# EAGLE design Temperature sensor 32U4 (EAGLE 9.5.2)
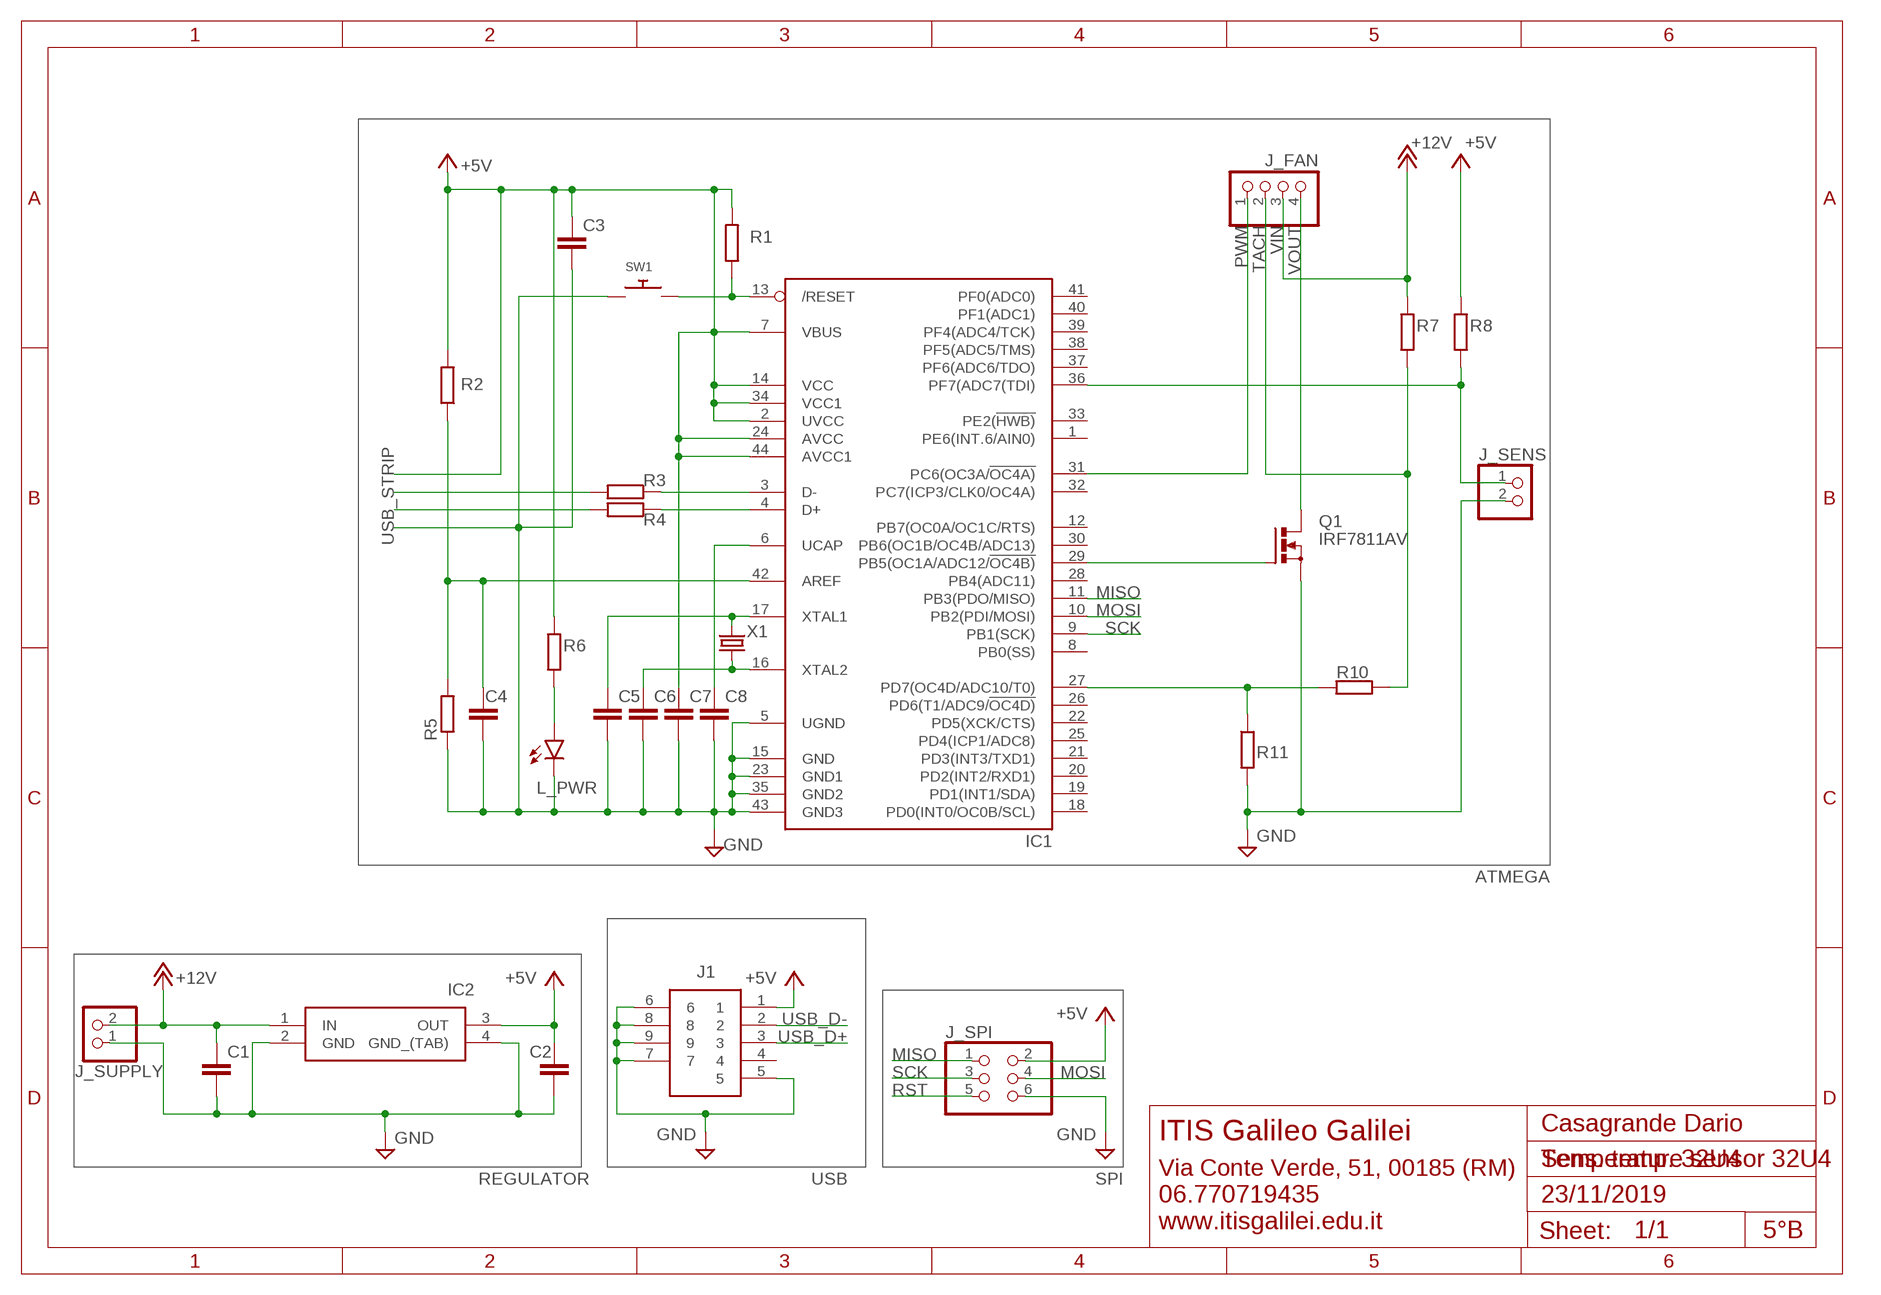
[diagram p0: schematic, sheet 1]

## Parts
C1  470n  C-EUC1206  [C1206]
C2  47u  C-EUC1206  [C1206]
C3  1u  C-EUC1206  [C1206]
C4  1u  C-EUC1206  [C1206]
C5  22p  C-EUC1206  [C1206]
C6  22p  C-EUC1206  [C1206]
C7  100n  C-EUC1206  [C1206]
C8  1u  C-EUC1206  [C1206]
IC1  ATMEGA32U4-AU  [TQFP44]
IC2  LM2940CS-5.0_NOPB  [TO254P1435X464-4N]
J1  10104111-0001LF  [101041110001LF]
J_FAN  PINHD-1X4  [1X04]
J_SENS  PINHD-1X2  [1X02]
J_SPI  PINHD-2X3  [2X03]
J_SUPPLY  PINHD-1X2  [1X02]
L_PWR  LEDCHIPLED_1206  [CHIPLED_1206]
Q1  IRF7811AV  N-MOSFET-SO8S  [SO-08]
R1  10k  R-EU_R1206  [R1206]
R2  1,8k  R-EU_R1206  [R1206]
R3  10  R-EU_R1206  [R1206]
R4  10  R-EU_R1206  [R1206]
R5  8,2k  R-EU_R1206  [R1206]
R6  270  R-EU_R1206  [R1206]
R7  10k  R-EU_R1206  [R1206]
R8  10k  R-EU_R1206  [R1206]
R10  10k  R-EU_R1206  [R1206]
R11  14k  R-EU_R1206  [R1206]
SW1  SWITCH_PUSHBUTTONSOFTTOUCHSMD_SJ  [PUSHBUTTON_SMD_SJ]
X1  16MHz  CRYSTALHC49S  [HC49/S]

## Nets
+5V: C2.1 C3.1 C7.1 IC1.2(UVCC) IC1.7(VBUS) IC1.14(VCC) IC1.24(AVCC) IC1.34(VCC1) IC1.44(AVCC1) IC2.3(OUT) J1.1 J_SPI.2 R1.2 R2.2 R6.1 R8.1
+12V: C1.1 IC2.1(IN) J_SUPPLY.2
AREF: C4.1 IC1.42(AREF) R2.1 R5.2
D+: IC1.4(D+) R4.1
D-: IC1.3(D-) R3.1
GND: C1.2 C2.2 C3.2 C4.2 C5.2 C6.2 C7.2 C8.2 IC1.5(UGND) IC1.15(GND) IC1.23(GND1) IC1.35(GND2) IC1.43(GND3) IC2.2(GND) IC2.4(GND_(TAB)) J1.5 J1.6 J1.7 J1.8 J1.9 J_SENS.2 J_SPI.6 J_SUPPLY.1 L_PWR.C Q1.1(S) Q1.2(S) Q1.3(S) R5.1 R11.2 SW1.P$1
MISO: IC1.11(PB3(PDO/MISO)) J_SPI.1
MOSI: IC1.10(PB2(PDI/MOSI)) J_SPI.4
N$1: L_PWR.A R6.2
N$2: IC1.29(PB5(OC1A/ADC12/!OC4B)) Q1.4(G)
PWM: IC1.31(PC6(OC3A/!OC4A)) J_FAN.1
RST: IC1.13(/RESET) J_SPI.5 R1.1 SW1.P$2
SCK: IC1.9(PB1(SCK)) J_SPI.3
SENS: IC1.36(PF7(ADC7(TDI)) J_SENS.1 R8.2
TACH: J_FAN.2 R7.2 R10.1
TACH_IN: IC1.27(PD7(OC4D/ADC10/T0)) R10.2 R11.1
UCAP: C8.1 IC1.6(UCAP)
USB_D+: J1.3 R4.2
USB_D-: J1.2 R3.2
VIN: J_FAN.3 R7.1 ; supply symbol labelled +12V
VOUT: J_FAN.4 Q1.5(D) Q1.6(D) Q1.7(D) Q1.8(D)
XTAL1: C5.1 IC1.17(XTAL1) X1.2
XTAL2: C6.1 IC1.16(XTAL2) X1.1
Unconnected: IC1.1(PE6(INT.6/AIN0)) IC1.8(PB0(SS)) IC1.12(PB7(OC0A/OC1C/RTS)) IC1.18(PD0(INT0/OC0B/SCL)) IC1.19(PD1(INT1/SDA)) IC1.20(PD2(INT2/RXD1)) IC1.21(PD3(INT3/TXD1)) IC1.22(PD5(XCK/CTS)) IC1.25(PD4(ICP1/ADC8)) IC1.26(PD6(T1/ADC9/!OC4D)) IC1.28(PB4(ADC11)) IC1.30(PB6(OC1B/OC4B/ADC13)) IC1.32(PC7(ICP3/CLK0/OC4A)) IC1.33(PE2(!HWB)) IC1.37(PF6(ADC6/TDO)) IC1.38(PF5(ADC5/TMS)) IC1.39(PF4(ADC4/TCK)) IC1.40(PF1(ADC1)) IC1.41(PF0(ADC0)) J1.4

## Notes on the sheet
- USB_STRIP
- ATMEGA
- Casagrande Dario
- ITIS Galileo Galilei
- Sens. temp. 32U4
- Via Conte Verde, 51, 00185 (RM)
- REGULATOR | USB | SPI
- 06.770719435 | 23/11/2019
- www.itisgalilei.edu.it
- 5°B

## Library data of the parts
C1-C8 = rcl:C-EU: CAPACITOR, European symbol; SPICEPREFIX: C
IC1 = adafruit:ATMEGA32U4: http://www.ladyada.net/library/eagle
IC2 = LM2940CS-5.0_NOPB:LM2940CS-5.0_NOPB: 1A,5V,LDO Voltage Regulator,LM2940CS-5.0 Source: Datasheet <http://www.ti.com/lit/ds/symlink/lm2940c.pdf>; DESCRIPTION: 1A,5V,LDO Voltage Regulator,LM2940CS-5.0; HEIGHT: 4.64mm; MANUFACTURER_NAME: Texas Instruments; MANUFACTURER_PART_NUMBER: LM2940CS-5.0/NOPB; MOUSER_PART_NUMBER: 926-LM2940CS-5.0NOPB; MOUSER_PRICE-STOCK: https://www.mouser.com/Search/Refine.aspx?Keyword=926-LM2940CS-5.0NOPB; RS_PART_NUMBER: 2508123693; RS_PRICE-STOCK: http://uk.rs-online.com/web/p/products/2508123693
J1 = USB:10104111-0001LF: USB Connectors 5P Quick Connect MicroUSB TypeAB Rcpt Source: Datasheet <https://cdn.amphenol-icc.com/media/wysiwyg/files/drawing/10104111.pdf>; ALLIED_NUMBER: 70236825; ALLIED_PRICE-STOCK: https://www.alliedelec.com/amphenolfci-10104111-0001lf/70236825/; DESCRIPTION: USB Connectors 5P Quick Connect MicroUSB TypeAB Rcpt; HEIGHT: 3.07mm; MANUFACTURER_NAME: Amphenol; MANUFACTURER_PART_NUMBER: 10104111-0001LF; MOUSER_PART_NUMBER: 649-10104111-0001LF; MOUSER_PRICE-STOCK: https://www.mouser.com/Search/Refine.aspx?Keyword=649-10104111-0001LF; RS_PART_NUMBER: 7142353; RS_PRICE-STOCK: http://uk.rs-online.com/web/p/products/7142353
J_FAN = pinhead:PINHD-1X4: PIN HEADER
J_SENS J_SUPPLY = pinhead:PINHD-1X2: PIN HEADER
J_SPI = pinhead:PINHD-2X3: PIN HEADER
L_PWR = led:LED: LED OSRAM: - CHIPLED LG R971, LG N971, LY N971, LG Q971, LY Q971, LO R971, LY R971 LH N974, LH R974 LS Q976, LO Q976, LY Q976 LO Q996 - Hyper CHIPLED LW Q18S LB Q993, LB Q99A, LB R99A - SideLED LS A670, LO A670, LY A670, LG A670, LP A670 LB A673, LV A673, LT A673, LW A673 LH A674 LY A675 LS A676, LA A676, LO A676, LY A676, LW A676 LS A679, LY A679, LG A679 - Hyper Micro SIDELED® LS Y876, LA Y876, LO Y876, LY Y876 LT Y87S - SmartLED LW L88C, LW L88S LB L89C, LB L89S, LG L890 LS L89K, LO L89K, LY L89K LS L896, LA L896, LO L896, LY L896 - TOPLED LS T670, LO T670, LY T670, LG T670, LP T670 LSG T670, LSP T670, LSY T670, LOP T670, LYG T670 LG T671, LOG T671, LSG T671 LB T673, LV T673, LT T673, LW T673 LH T674 LS T676, LA T676, LO T676, LY T676, LB T676, LH T676, LSB T676, LW T676 LB T67C, LV T67C, LT T67C, LS T67K, LO T67K, LY T67K, LW E67C LS E67B, LA E67B, LO E67B, LY E67B, LB E67C, LV E67C, LT E67C LW T67C LS T679, LY T679, LG T679 LS T770, LO T770, LY T770, LG T770, LP T770 LB T773, LV T773, LT T773, LW T773 LH T774 LS E675, LA E675, LY E675, LS T675 LS T776, LA T776, LO T776, LY T776, LB T776 LHGB T686 LT T68C, LB T68C - Hyper Mini TOPLED® LB M676 - Mini TOPLED Santana® LG M470 LS M47K, LO M47K, LY M47K Source: http://www.osram.convergy.de LUXEON: - LUMILED® LXK2-PW12-R00, LXK2-PW12-S00, LXK2-PW14-U00, LXK2-PW14-V00 LXK2-PM12-R00, LXK2-PM12-S00, LXK2-PM14-U00 LXK2-PE12-Q00, LXK2-PE12-R00, LXK2-PE12-S00, LXK2-PE14-T00, LXK2-PE14-U00 LXK2-PB12-K00, LXK2-PB12-L00, LXK2-PB12-M00, LXK2-PB14-N00, LXK2-PB14-P00, LXK2-PB14-Q00 LXK2-PR12-L00, LXK2-PR12-M00, LXK2-PR14-Q00, LXK2-PR14-R00 LXK2-PD12-Q00, LXK2-PD12-R00, LXK2-PD12-S00 LXK2-PH12-R00, LXK2-PH12-S00 LXK2-PL12-P00, LXK2-PL12-Q00, LXK2-PL12-R00 Source: www.luxeon.com KINGBRIGHT: KA-3528ASYC Source: www.kingbright.com
Q1 = transistor-power:N-MOSFET-SO8: N-Channel MOSFET Example: FDS7760A; N-Channel Logic Level PowerTrench® MOSFET FDS2572; N-Channel UltraFET® Trench MOSFET Source: www.fairchildsemi.com
R1-R8 R10 R11 = rcl:R-EU_: RESISTOR, European symbol; SPICEPREFIX: R
SW1 = adafruit:SWITCH_PUSHBUTTON: Buttons SOFTTOUCHSMD_SJ - Soft touch temporary push button (Super Junk Akihabara) Compatible with SKPMANE010 [Mouser: 688-SKPMAN] C&K_KSS = Digikey: KSS221GLFS
X1 = adafruit:CRYSTAL: CRYSTAL; OC_FARNELL: 1667008; OC_NEWARK: unknown

## Board
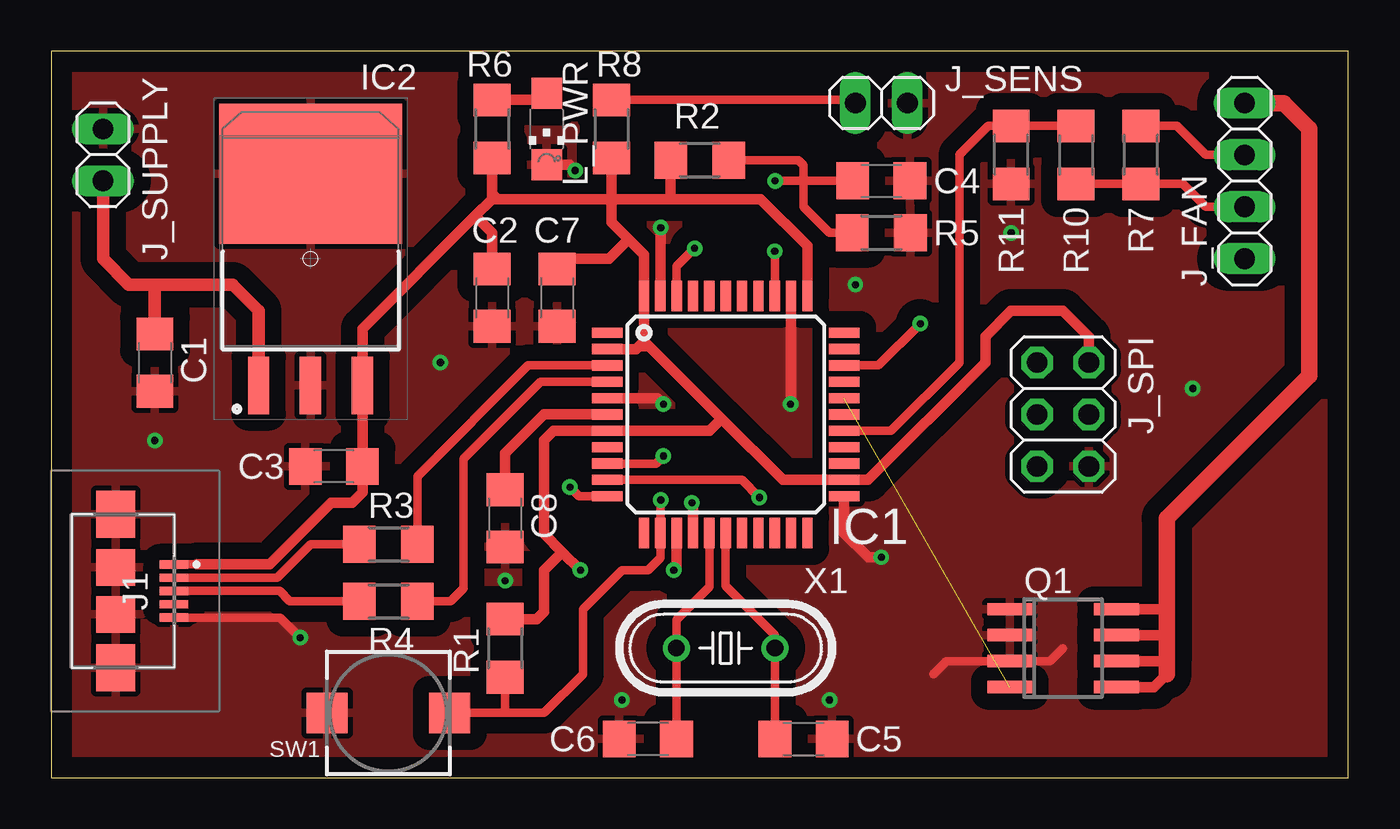
[diagram p1: board, top side]
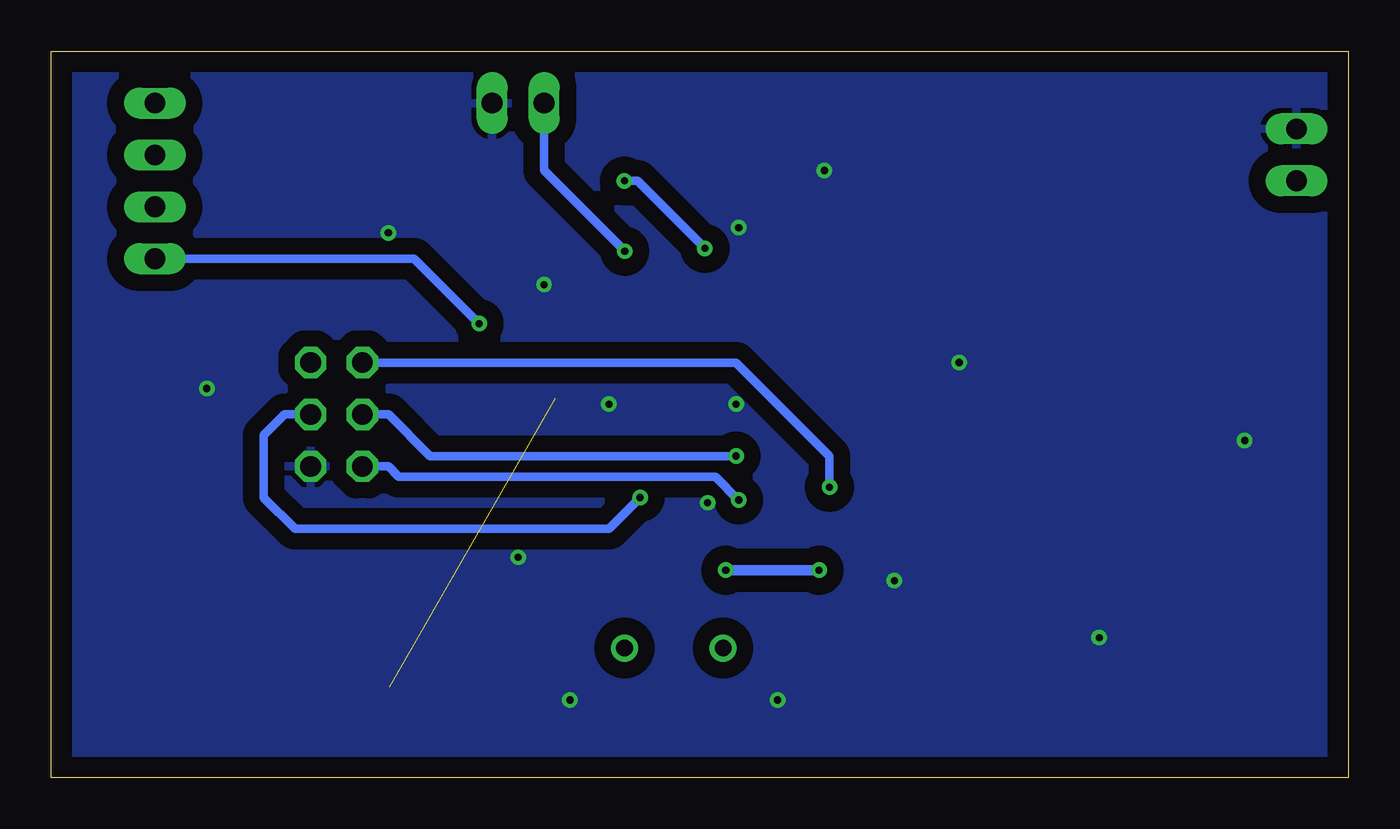
[diagram p2: board, bottom side, seen from below]

Size 63.5 x 35.56 mm. Coordinates in mm from the lower left corner, seen from the top.
Outline: 0,0 63.5,0 63.5,35.56 0,35.56 0,0
Copper layers (1*16): Top 0.035mm / dielectric 1.5mm / Bottom 0.035mm
Design rules "default": minimum track width 6mil, minimum drill 0.35mm, track to track 6mil, track to pad 6mil, pad to pad 6mil, via to via 6mil, smd to smd 6mil, copper to edge 40mil, drill to drill 6mil, minimum pad ring 10mil, minimum via ring 8mil, stop-mask expansion 4mil, vias tented up to drill 0mil, thermal gap 10mil

### Footprints (pad centres in the part's own frame; a part is rotated, then mirrored left to right if it is on the bottom)
C1206 = smd 1.6 x 1.8: 1 -1.4,0; 2 1.4,0
TQFP44 = smd 1.5 x 0.5: 1 -5.8,4; 2 -5.8,3.2; 3 -5.8,2.4; 4 -5.8,1.6; 5 -5.8,0.8; 6 -5.8,0; 7 -5.8,-0.8; 8 -5.8,-1.6; 9 -5.8,-2.4; 10 -5.8,-3.2; 11 -5.8,-4; 23 5.8,-4; 24 5.8,-3.2; 25 5.8,-2.4; 26 5.8,-1.6; 27 5.8,-0.8; 28 5.8,0; 29 5.8,0.8; 30 5.8,1.6; 31 5.8,2.4; 32 5.8,3.2; 33 5.8,4 | smd 0.5 x 1.5: 12 -4,-5.8; 13 -3.2,-5.8; 14 -2.4,-5.8; 15 -1.6,-5.8; 16 -0.8,-5.8; 17 0,-5.8; 18 0.8,-5.8; 19 1.6,-5.8; 20 2.4,-5.8; 21 3.2,-5.8; 22 4,-5.8; 34 4,5.8; 35 3.2,5.8; 36 2.4,5.8; 37 1.6,5.8; 38 0.8,5.8; 39 0,5.8; 40 -0.8,5.8; 41 -1.6,5.8; 42 -2.4,5.8; 43 -3.2,5.8; 44 -4,5.8
TO254P1435X464-4N = smd 2.8 x 1.05: 1 -6.2,2.54; 2 -6.2,0; 3 -6.2,-2.54 | smd 6.85 x 8.95: 4 4.15,0
101041110001LF = smd 0.4 x 1.4: 1 -1.3,5; 2 -0.65,5; 3 0,5; 4 0.65,5; 5 1.3,5 | smd 2.3 x 1.9: 6 -3.75,2.15; 7 3.75,2.15 | smd 1.8 x 1.9: 8 -1.15,2.15; 9 1.15,2.15
1X04 = drill 1.016 long: 1 -3.81,0; 2 -1.27,0; 3 1.27,0; 4 3.81,0
1X02 = drill 1.016 long: 1 -1.27,0; 2 1.27,0
2X03 = drill 1.016 octagon: 1 -2.54,-1.27; 2 -2.54,1.27; 3 0,-1.27; 4 0,1.27; 5 2.54,-1.27; 6 2.54,1.27
CHIPLED_1206 = smd 1.5 x 1.5: A 0,-1.75; C 0,1.75
SO-08 = smd 0.6 x 2.2: 1 -1.905,-2.6; 2 -0.635,-2.6; 3 0.635,-2.6; 4 1.905,-2.6; 5 1.905,2.6; 6 0.635,2.6; 7 -0.635,2.6; 8 -1.905,2.6
R1206 = smd 1.6 x 1.803: 1 -1.422,0; 2 1.422,0
PUSHBUTTON_SMD_SJ = smd 2 x 2: P$1 3,0; P$2 -3,0
HC49/S = drill 0.813: 1 -2.413,0; 2 2.413,0

### Placement (x,y rotation side)
C1  5.08,20.32 270 top
C2  21.59,23.5 270 top
C3  13.84,15.24 180 top
C4  40.64,29.21 0 top
C5  36.83,1.91 0 top
C6  29.21,1.91 180 top
C7  24.77,23.5 270 top
C8  22.23,12.7 270 top
IC1  33.02,17.78 0 top
IC2  12.7,25.4 90 top
J1  1.02,9.14 270 top
J_FAN  58.42,29.21 90 top
J_SENS  40.64,33.02 0 top
J_SPI  49.53,17.78 270 top
J_SUPPLY  2.54,30.48 270 top
L_PWR  24.26,31.75 180 top
Q1  49.53,6.35 270 top
R1  22.23,6.35 90 top
R2  31.75,30.23 180 top
R3  16.51,11.43 180 top
R4  16.51,8.64 180 top
R5  40.64,26.67 180 top
R6  21.59,31.75 90 top
R7  53.34,30.48 270 top
R8  27.43,31.75 90 top
R10  50.16,30.48 90 top
R11  46.99,30.48 270 top
SW1  16.51,3.17 180 top
X1  33.02,6.35 0 top

### Tracks (layer width: path | path; a pad name or v marks a point on that pad's centre or on a via)
+5V  (via drill 0.35)
  Top 0.203: 28.63,20.98 29.36,20.98 29.39,21.01
  Top 0.406: J1.1 7.14,10.44
  Top 0.508: IC1.34 37.02,26.04 34.73,28.32 30.48,28.32 | 21.59,28.32 21.84,28.32 | 21.84,28.32 27.3,28.32 | 27.3,28.32 30.48,28.32 | 21.59,28.32 20.77,27.5 | 20.77,27.5 15.24,21.97 IC2.3 C3.1 | R8.1 27.43,28.45 | 27.43,28.45 27.3,28.32 | R6.1 21.59,28.57 | 21.59,28.57 21.59,28.32 | 21.59,28.57 21.84,28.32 | C3.1 | C3.1 15.24,13.97 14.73,13.46 13.72,13.46 10.7,10.44 7.14,10.44 | R2.2 30.33,28.47 30.48,28.32 | 28.26,26.35 29.02,25.59 IC1.44 29.02,21.37 | 28.26,26.35 27.43,27.18 27.43,28.45 | 32.82,17.58 35.81,14.58 IC1.24 39.98,14.58 45.72,20.32 45.72,21.59 46.99,22.86 49.53,22.86 50.8,21.59 J_SPI.2 | 32.82,17.58 29.39,21.01 29.02,21.37 | C2.1 21.59,26.67 20.77,27.5 | C7.1 25.27,25.4 27.3,25.4 28.26,26.35 | IC1.2 28.63,20.98 29.02,21.37 | 32.82,17.58 32.22,16.98 IC1.7 24.6,16.98 24.13,16.51 24.13,11.94 25.02,11.05 | 25.02,11.05 v25.91,10.16 | IC1.14 30.62,10.3 v30.48,10.16 | R1.2 23.77,7.77 24.13,8.13 24.13,10.16 25.02,11.05
  Bottom 0.508: v25.91,10.16 v30.48,10.16
+12V
  Top 0.61: 5.08,24.13 8.89,24.13 10.16,22.86 IC2.1 | 5.08,24.13 3.81,24.13 2.54,25.4 J_SUPPLY.2 | C1.1 5.08,24.13
AREF  (via drill 0.35)
  Top 0.406: R5.2 38.1,26.67 36.83,27.94 36.83,29.21 | C4.1 36.83,29.21 | R2.1 36.58,30.23 36.83,29.97 36.83,29.21 | 36.83,29.21 v35.43,29.21 | v31.5,25.91 30.62,25.03 IC1.42
  Bottom 0.406: v31.5,25.91 34.8,29.21 v35.43,29.21
D+
  Top 0.406: R4.1 19.56,8.64 20.19,9.27 20.19,15.62 23.95,19.38 IC1.4
D-
  Top 0.406: IC1.3 23.36,20.18 17.93,14.76 R3.1
GND  (via drill 0.35)
  Top 0.406: v12.19,6.86 11.21,7.84 J1.5 | 43.18,5.08 43.81,5.71 Q1.3 48.9,5.71 49.53,6.35
  Top 0.508: IC1.15 31.42,13.41 v31.37,13.46 | IC1.23 38.82,11.98 40.01,10.79 v40.64,10.79 | IC1.43 29.82,26.9 v29.84,26.92 | IC1.5 29.68,18.58 v29.97,18.29 | L_PWR.C 25.37,30 v25.65,29.72 | IC1.35 36.22,18.31 v36.2,18.29
  other vias: 19.05,20.32 22.23,9.65 46.99,26.67 55.88,19.05 27.94,3.81 38.1,3.81 39.37,24.13 5.08,16.51
  pour Bottom (isolate 0.813): -1.27,36.83 64.77,36.83 64.77,-1.27 -1.27,-1.27
  pour Top (isolate 0.813): 0,35.56 63.5,35.56 63.5,0 0,0
MISO  (via drill 0.35)
  Top 0.406: v25.4,14.22 25.84,13.78 IC1.11
  Bottom 0.406: J_SPI.1 29.97,20.32 25.4,15.75 v25.4,14.22
MOSI  (via drill 0.35)
  Top 0.406: IC1.10 33.81,14.58 v34.67,13.72
  Bottom 0.406: v34.67,13.72 36.2,12.19 51.56,12.19 53.09,13.72 53.09,16.76 52.07,17.78 J_SPI.4
N$1
  Top 0.508: R6.2 23.93,33.17 L_PWR.A
N$2  (1 unrouted)
PWM  (via drill 0.35)
  Top 0.406: v42.55,22.23 40.5,20.18 IC1.31
  Bottom 0.406: v42.55,22.23 45.72,25.4 J_FAN.1
RST  (via drill 0.35)
  Top 0.406: 22.23,3.17 SW1.P$2 | v29.84,13.59 29.82,13.57 IC1.13 29.82,10.77 29.21,10.16 27.94,10.16 26.04,8.26 26.04,5.08 24.13,3.17 22.23,3.17 | R1.1 22.23,3.17
  Bottom 0.406: v29.84,13.59 30.98,14.73 46.48,14.73 46.99,15.24 J_SPI.5
SCK  (via drill 0.35)
  Top 0.406: IC1.9 29.6,15.38 v29.97,15.75
  Bottom 0.406: J_SPI.3 46.99,17.78 44.96,15.75 v29.97,15.75
SENS  (via drill 0.35)
  Top 0.406: R8.2 39.22,33.17 J_SENS.1 | v35.42,25.77 v35.42,25.76 IC1.36
  Bottom 0.406: J_SENS.1 39.37,29.72 v35.42,25.77
TACH
  Top 0.406: R10.1 R7.2 55.4,29.06 56.52,27.94 J_FAN.2
TACH_IN
  Top 0.406: IC1.27 41.11,16.98 44.45,20.32 44.45,30.48 45.87,31.9 R11.1 R10.2
UCAP
  Top 0.508: C8.1 22.23,15.88 24.13,17.78 IC1.6
USB_D+
  Top 0.406: R4.2 11.68,8.64 11.18,9.14 J1.3
USB_D-
  Top 0.406: R3.2 12.7,11.43 11.06,9.79 J1.2
VIN
  Top 0.406: R7.1 55.09,31.9 56.52,30.48 J_FAN.3
VOUT
  Top 0.508: Q1.8 54.61,8.26 | Q1.7 54.61,6.99 | Q1.6 54.61,5.71 | Q1.5 53.98,4.45 54.61,5.08
  Top 0.813: J_FAN.4 60.33,33.02 61.59,31.75 61.59,19.68 54.61,12.7 54.61,8.26 54.61,6.99 54.61,5.71 54.61,5.08
XTAL1
  Top 0.406: IC1.17 33.02,9.4 35.43,6.99 X1.2 C5.1
XTAL2
  Top 0.406: IC1.16 32.22,9.36 30.61,7.75 X1.1 C6.1